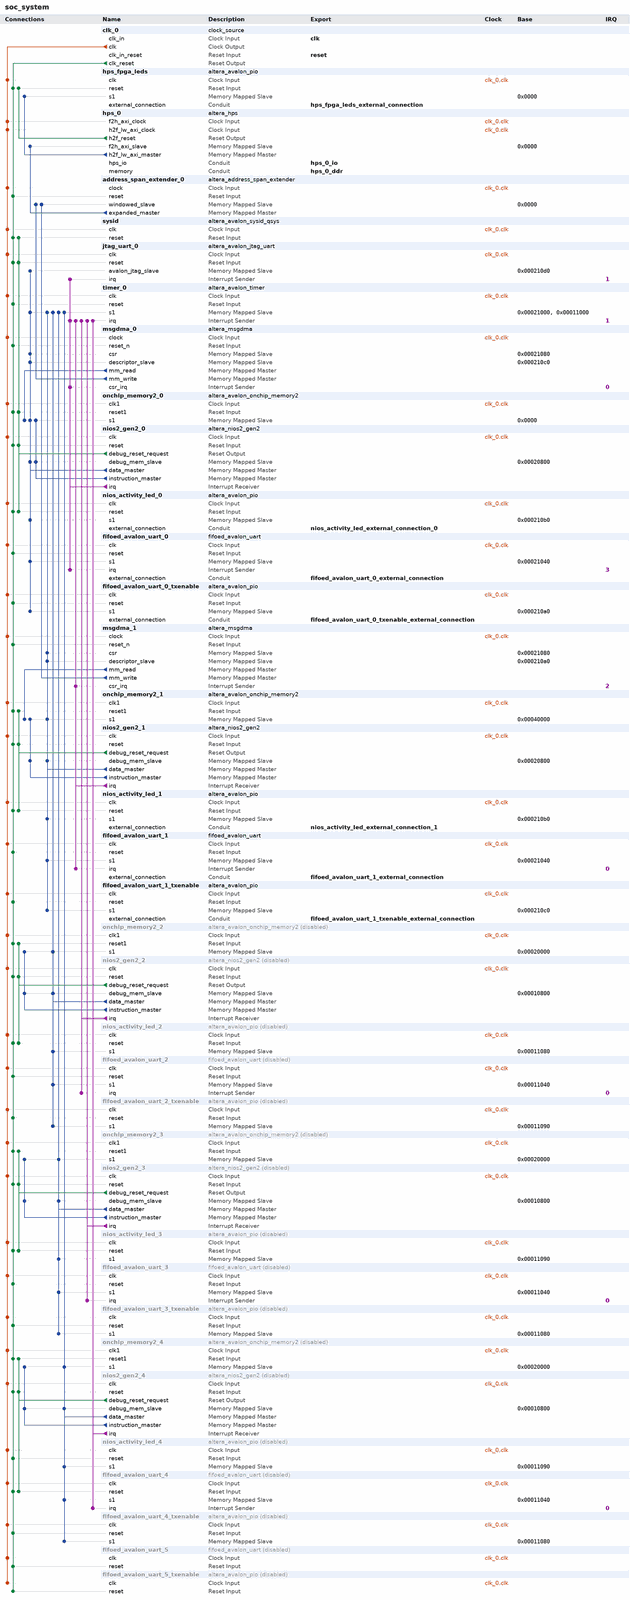
[diagram p0: system contents, whole]
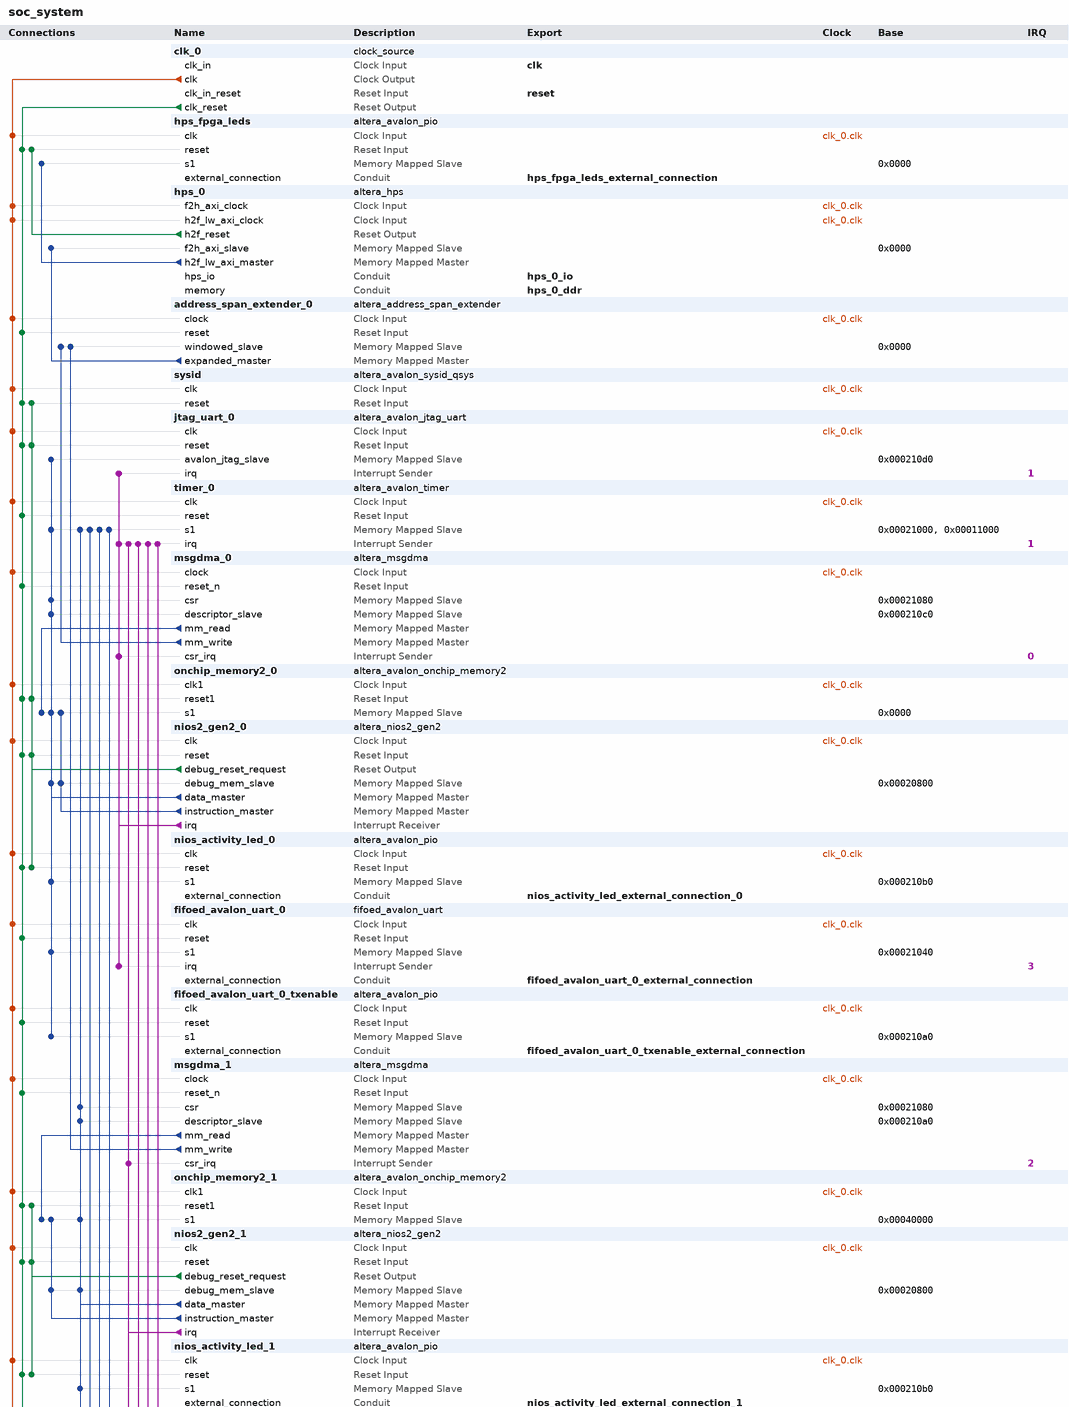
[diagram p1: system contents, upper part]
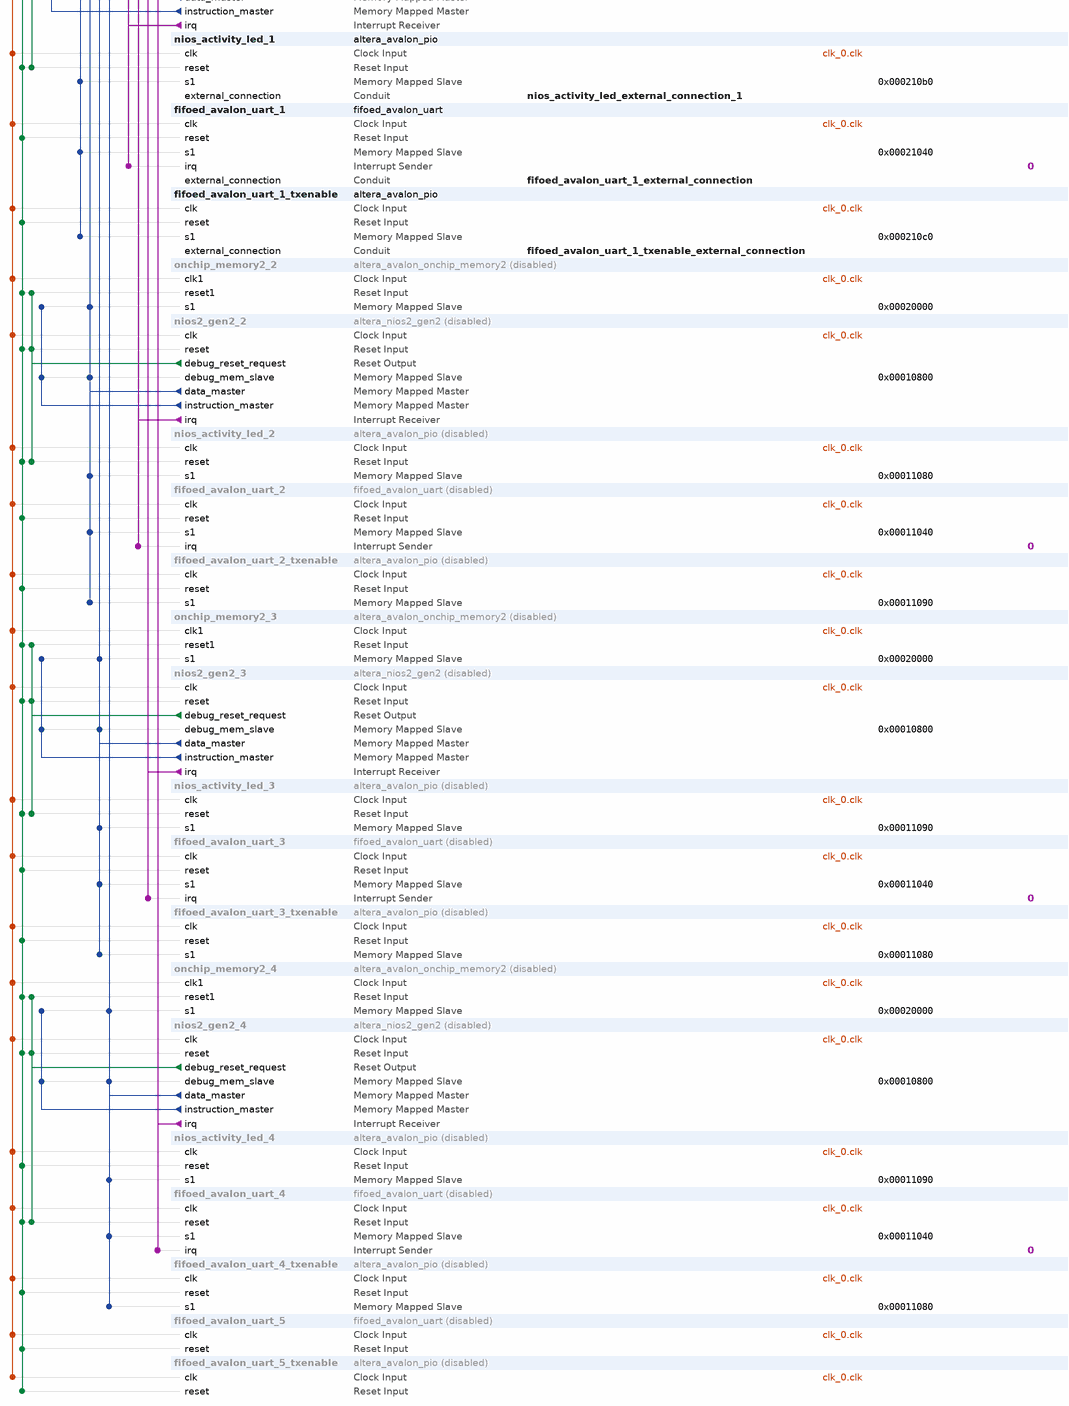
[diagram p2: system contents, lower part]
# Platform Designer (Qsys) system soc_system, Cyclone V 5CSEMA4U23C6
# Parameters at their usual value, and those the tool derives, are not listed.
package require -exact qsys 18.0
create_system soc_system
set_project_property DEVICE_FAMILY {Cyclone V}
set_project_property DEVICE 5CSEMA4U23C6

add_instance clk_0 clock_source 18.0
set_instance_parameter_value clk_0 clockFrequency 50000000

add_instance hps_fpga_leds altera_avalon_pio 18.0
set_instance_parameter_value hps_fpga_leds direction Output
set_instance_parameter_value hps_fpga_leds width 2

add_instance hps_0 altera_hps 18.0
set_instance_parameter_value hps_0 EMAC1_Mode RGMII
set_instance_parameter_value hps_0 EMAC1_PinMuxing {HPS I/O Set 0}
set_instance_parameter_value hps_0 F2SCLK_COLDRST_Enable false
set_instance_parameter_value hps_0 F2SCLK_DBGRST_Enable false
set_instance_parameter_value hps_0 F2SCLK_WARMRST_Enable false
set_instance_parameter_value hps_0 F2SINTERRUPT_Enable false
set_instance_parameter_value hps_0 F2S_Width 3
set_instance_parameter_value hps_0 FPGA_PERIPHERAL_OUTPUT_CLOCK_FREQ_EMAC0_GTX_CLK 125
set_instance_parameter_value hps_0 FPGA_PERIPHERAL_OUTPUT_CLOCK_FREQ_EMAC0_MD_CLK 2.5
set_instance_parameter_value hps_0 FPGA_PERIPHERAL_OUTPUT_CLOCK_FREQ_EMAC1_GTX_CLK 125
set_instance_parameter_value hps_0 FPGA_PERIPHERAL_OUTPUT_CLOCK_FREQ_EMAC1_MD_CLK 2.5
set_instance_parameter_value hps_0 HPS_PROTOCOL DDR3
set_instance_parameter_value hps_0 I2C0_Mode I2C
set_instance_parameter_value hps_0 I2C0_PinMuxing {HPS I/O Set 0}
set_instance_parameter_value hps_0 I2C1_Mode I2C
set_instance_parameter_value hps_0 I2C1_PinMuxing {HPS I/O Set 0}
set_instance_parameter_value hps_0 LWH2F_Enable true
set_instance_parameter_value hps_0 MEM_BANKADDR_WIDTH 3
set_instance_parameter_value hps_0 MEM_CLK_FREQ 400.0
set_instance_parameter_value hps_0 MEM_COL_ADDR_WIDTH 10
set_instance_parameter_value hps_0 MEM_DQ_WIDTH 32
set_instance_parameter_value hps_0 MEM_DRV_STR RZQ/6
set_instance_parameter_value hps_0 MEM_ROW_ADDR_WIDTH 15
set_instance_parameter_value hps_0 MEM_RTT_NOM RZQ/6
set_instance_parameter_value hps_0 MEM_RTT_WR {Dynamic ODT off}
set_instance_parameter_value hps_0 MEM_TCL 7
set_instance_parameter_value hps_0 MEM_TFAW_NS 37.5
set_instance_parameter_value hps_0 MEM_TRAS_NS 35.0
set_instance_parameter_value hps_0 MEM_TRCD_NS 13.75
set_instance_parameter_value hps_0 MEM_TRFC_NS 300.0
set_instance_parameter_value hps_0 MEM_TRP_NS 13.75
set_instance_parameter_value hps_0 MEM_VENDOR Other
set_instance_parameter_value hps_0 MEM_WTCL 7
set_instance_parameter_value hps_0 QSPI_Mode N/A
set_instance_parameter_value hps_0 QSPI_PinMuxing Unused
set_instance_parameter_value hps_0 REF_CLK_FREQ 25.0
set_instance_parameter_value hps_0 S2FCLK_USER2CLK 1
set_instance_parameter_value hps_0 S2F_Width 0
set_instance_parameter_value hps_0 SDIO_Mode {4-bit Data}
set_instance_parameter_value hps_0 SDIO_PinMuxing {HPS I/O Set 0}
set_instance_parameter_value hps_0 SPIM1_Mode {Single Slave Select}
set_instance_parameter_value hps_0 SPIM1_PinMuxing {HPS I/O Set 0}
set_instance_parameter_value hps_0 STM_Enable false
set_instance_parameter_value hps_0 TIMING_BOARD_AC_SKEW 0.02
set_instance_parameter_value hps_0 TIMING_BOARD_AC_TO_CK_SKEW 0.0
set_instance_parameter_value hps_0 TIMING_BOARD_DQ_TO_DQS_SKEW 0.0
set_instance_parameter_value hps_0 TIMING_BOARD_MAX_CK_DELAY 0.6
set_instance_parameter_value hps_0 TIMING_BOARD_MAX_DQS_DELAY 0.6
set_instance_parameter_value hps_0 TIMING_BOARD_SKEW_BETWEEN_DQS 0.02
set_instance_parameter_value hps_0 TIMING_BOARD_SKEW_CKDQS_DIMM_MAX 0.01
set_instance_parameter_value hps_0 TIMING_BOARD_SKEW_CKDQS_DIMM_MIN -0.01
set_instance_parameter_value hps_0 TIMING_BOARD_SKEW_WITHIN_DQS 0.02
set_instance_parameter_value hps_0 TIMING_TDH 125
set_instance_parameter_value hps_0 TIMING_TDQSCK 400
set_instance_parameter_value hps_0 TIMING_TDQSQ 120
set_instance_parameter_value hps_0 TIMING_TDS 50
set_instance_parameter_value hps_0 TIMING_TIH 250
set_instance_parameter_value hps_0 TIMING_TIS 175
set_instance_parameter_value hps_0 TIMING_TQSH 0.38
set_instance_parameter_value hps_0 UART0_Mode {No Flow Control}
set_instance_parameter_value hps_0 UART0_PinMuxing {HPS I/O Set 0}
set_instance_parameter_value hps_0 USB1_Mode SDR
set_instance_parameter_value hps_0 USB1_PinMuxing {HPS I/O Set 0}
set_instance_parameter_value hps_0 desired_cfg_clk_mhz 100.0
set_instance_parameter_value hps_0 desired_qspi_clk_mhz 400.0

add_instance address_span_extender_0 altera_address_span_extender 18.0
set_instance_parameter_value address_span_extender_0 BURSTCOUNT_WIDTH 8
set_instance_parameter_value address_span_extender_0 DATA_WIDTH 32
set_instance_parameter_value address_span_extender_0 ENABLE_SLAVE_PORT false
set_instance_parameter_value address_span_extender_0 MASTER_ADDRESS_DEF 536870912
set_instance_parameter_value address_span_extender_0 MAX_PENDING_READS 1
set_instance_parameter_value address_span_extender_0 SLAVE_ADDRESS_WIDTH 27

add_instance sysid altera_avalon_sysid_qsys 18.0
set_instance_parameter_value sysid id 0

add_instance jtag_uart_0 altera_avalon_jtag_uart 18.0
set_instance_parameter_value jtag_uart_0 simInteractiveOptions NO_INTERACTIVE_WINDOWS

add_instance timer_0 altera_avalon_timer 18.0
set_instance_parameter_value timer_0 alwaysRun true
set_instance_parameter_value timer_0 counterSize 64
set_instance_parameter_value timer_0 period 1
set_instance_parameter_value timer_0 periodUnits MSEC

add_instance msgdma_0 altera_msgdma 18.0
set_instance_parameter_value msgdma_0 BURST_ENABLE 0
set_instance_parameter_value msgdma_0 DATA_FIFO_DEPTH 32
set_instance_parameter_value msgdma_0 DATA_WIDTH 32
set_instance_parameter_value msgdma_0 DESCRIPTOR_FIFO_DEPTH 128
set_instance_parameter_value msgdma_0 ENHANCED_FEATURES 0
set_instance_parameter_value msgdma_0 ERROR_ENABLE 0
set_instance_parameter_value msgdma_0 MAX_BURST_COUNT 2
set_instance_parameter_value msgdma_0 MAX_BYTE 8192
set_instance_parameter_value msgdma_0 MODE 0
set_instance_parameter_value msgdma_0 PACKET_ENABLE 0
set_instance_parameter_value msgdma_0 TRANSFER_TYPE {Unaligned Accesses}

add_instance onchip_memory2_0 altera_avalon_onchip_memory2 18.0
set_instance_parameter_value onchip_memory2_0 dataWidth 32
set_instance_parameter_value onchip_memory2_0 dualPort false
set_instance_parameter_value onchip_memory2_0 initMemContent true
set_instance_parameter_value onchip_memory2_0 initializationFileName mem_init_NIOS_0/soc_system_onchip_memory2_0.hex
set_instance_parameter_value onchip_memory2_0 memorySize 131072
set_instance_parameter_value onchip_memory2_0 useNonDefaultInitFile true

add_instance nios2_gen2_0 altera_nios2_gen2 18.0
set_instance_parameter_value nios2_gen2_0 dcache_size 2048
set_instance_parameter_value nios2_gen2_0 exceptionSlave onchip_memory2_0.s1
set_instance_parameter_value nios2_gen2_0 icache_size 4096
set_instance_parameter_value nios2_gen2_0 impl Tiny
set_instance_parameter_value nios2_gen2_0 resetSlave onchip_memory2_0.s1

add_instance nios_activity_led_0 altera_avalon_pio 18.0
set_instance_parameter_value nios_activity_led_0 direction Output
set_instance_parameter_value nios_activity_led_0 width 1

add_instance fifoed_avalon_uart_0 fifoed_avalon_uart 13.2
set_instance_parameter_value fifoed_avalon_uart_0 add_error_bits false
set_instance_parameter_value fifoed_avalon_uart_0 baud 1000000
set_instance_parameter_value fifoed_avalon_uart_0 dataBits 8
set_instance_parameter_value fifoed_avalon_uart_0 driver_pass_error_bits false
set_instance_parameter_value fifoed_avalon_uart_0 export_handshake false
set_instance_parameter_value fifoed_avalon_uart_0 fifo_export_used false
set_instance_parameter_value fifoed_avalon_uart_0 fifo_size_rx 256
set_instance_parameter_value fifoed_avalon_uart_0 fifo_size_tx 8
set_instance_parameter_value fifoed_avalon_uart_0 fixedBaud true
set_instance_parameter_value fifoed_avalon_uart_0 gap_value 3
set_instance_parameter_value fifoed_avalon_uart_0 hw_cts false
set_instance_parameter_value fifoed_avalon_uart_0 parity EVEN
set_instance_parameter_value fifoed_avalon_uart_0 rx_IRQ_Threshold 1
set_instance_parameter_value fifoed_avalon_uart_0 rx_fifo_LE false
set_instance_parameter_value fifoed_avalon_uart_0 simInteractiveInputEnable false
set_instance_parameter_value fifoed_avalon_uart_0 simInteractiveOutputEnable false
set_instance_parameter_value fifoed_avalon_uart_0 simTrueBaud false
set_instance_parameter_value fifoed_avalon_uart_0 stopBits 1
set_instance_parameter_value fifoed_avalon_uart_0 syncRegDepth 2
set_instance_parameter_value fifoed_avalon_uart_0 timeout_value 10
set_instance_parameter_value fifoed_avalon_uart_0 timestamp_width 8
set_instance_parameter_value fifoed_avalon_uart_0 trans_pin false
set_instance_parameter_value fifoed_avalon_uart_0 tx_IRQ_Threshold 1
set_instance_parameter_value fifoed_avalon_uart_0 tx_fifo_LE false
set_instance_parameter_value fifoed_avalon_uart_0 useCtsRts false
set_instance_parameter_value fifoed_avalon_uart_0 useEopRegister false
set_instance_parameter_value fifoed_avalon_uart_0 useRelativePathForSimFile false
set_instance_parameter_value fifoed_avalon_uart_0 use_ext_timestamp false
set_instance_parameter_value fifoed_avalon_uart_0 use_gap_detection true
set_instance_parameter_value fifoed_avalon_uart_0 use_rx_fifo true
set_instance_parameter_value fifoed_avalon_uart_0 use_status_bit_clear false
set_instance_parameter_value fifoed_avalon_uart_0 use_timestamp false
set_instance_parameter_value fifoed_avalon_uart_0 use_timout false
set_instance_parameter_value fifoed_avalon_uart_0 use_tx_fifo false

add_instance fifoed_avalon_uart_0_txenable altera_avalon_pio 18.0
set_instance_parameter_value fifoed_avalon_uart_0_txenable direction Output
set_instance_parameter_value fifoed_avalon_uart_0_txenable width 1

add_instance msgdma_1 altera_msgdma 18.0
set_instance_parameter_value msgdma_1 BURST_ENABLE 0
set_instance_parameter_value msgdma_1 DATA_FIFO_DEPTH 32
set_instance_parameter_value msgdma_1 DATA_WIDTH 32
set_instance_parameter_value msgdma_1 DESCRIPTOR_FIFO_DEPTH 128
set_instance_parameter_value msgdma_1 ENHANCED_FEATURES 0
set_instance_parameter_value msgdma_1 ERROR_ENABLE 0
set_instance_parameter_value msgdma_1 MAX_BURST_COUNT 2
set_instance_parameter_value msgdma_1 MAX_BYTE 8192
set_instance_parameter_value msgdma_1 MODE 0
set_instance_parameter_value msgdma_1 PACKET_ENABLE 0
set_instance_parameter_value msgdma_1 TRANSFER_TYPE {Unaligned Accesses}

add_instance onchip_memory2_1 altera_avalon_onchip_memory2 18.0
set_instance_parameter_value onchip_memory2_1 dataWidth 32
set_instance_parameter_value onchip_memory2_1 dualPort false
set_instance_parameter_value onchip_memory2_1 initMemContent true
set_instance_parameter_value onchip_memory2_1 initializationFileName mem_init_NIOS_1/soc_system_onchip_memory2_1.hex
set_instance_parameter_value onchip_memory2_1 memorySize 131072
set_instance_parameter_value onchip_memory2_1 useNonDefaultInitFile true

add_instance nios2_gen2_1 altera_nios2_gen2 18.0
set_instance_parameter_value nios2_gen2_1 dcache_size 2048
set_instance_parameter_value nios2_gen2_1 exceptionSlave onchip_memory2_1.s1
set_instance_parameter_value nios2_gen2_1 icache_size 4096
set_instance_parameter_value nios2_gen2_1 impl Tiny
set_instance_parameter_value nios2_gen2_1 resetSlave onchip_memory2_1.s1

add_instance nios_activity_led_1 altera_avalon_pio 18.0
set_instance_parameter_value nios_activity_led_1 direction Output
set_instance_parameter_value nios_activity_led_1 width 1

add_instance fifoed_avalon_uart_1 fifoed_avalon_uart 13.2
set_instance_parameter_value fifoed_avalon_uart_1 add_error_bits false
set_instance_parameter_value fifoed_avalon_uart_1 baud 1000000
set_instance_parameter_value fifoed_avalon_uart_1 dataBits 8
set_instance_parameter_value fifoed_avalon_uart_1 driver_pass_error_bits false
set_instance_parameter_value fifoed_avalon_uart_1 export_handshake false
set_instance_parameter_value fifoed_avalon_uart_1 fifo_export_used false
set_instance_parameter_value fifoed_avalon_uart_1 fifo_size_rx 256
set_instance_parameter_value fifoed_avalon_uart_1 fifo_size_tx 8
set_instance_parameter_value fifoed_avalon_uart_1 fixedBaud true
set_instance_parameter_value fifoed_avalon_uart_1 gap_value 3
set_instance_parameter_value fifoed_avalon_uart_1 hw_cts false
set_instance_parameter_value fifoed_avalon_uart_1 parity NONE
set_instance_parameter_value fifoed_avalon_uart_1 rx_IRQ_Threshold 1
set_instance_parameter_value fifoed_avalon_uart_1 rx_fifo_LE false
set_instance_parameter_value fifoed_avalon_uart_1 simInteractiveInputEnable false
set_instance_parameter_value fifoed_avalon_uart_1 simInteractiveOutputEnable false
set_instance_parameter_value fifoed_avalon_uart_1 simTrueBaud false
set_instance_parameter_value fifoed_avalon_uart_1 stopBits 1
set_instance_parameter_value fifoed_avalon_uart_1 syncRegDepth 2
set_instance_parameter_value fifoed_avalon_uart_1 timeout_value 4
set_instance_parameter_value fifoed_avalon_uart_1 timestamp_width 8
set_instance_parameter_value fifoed_avalon_uart_1 trans_pin false
set_instance_parameter_value fifoed_avalon_uart_1 tx_IRQ_Threshold 1
set_instance_parameter_value fifoed_avalon_uart_1 tx_fifo_LE false
set_instance_parameter_value fifoed_avalon_uart_1 useCtsRts false
set_instance_parameter_value fifoed_avalon_uart_1 useEopRegister false
set_instance_parameter_value fifoed_avalon_uart_1 useRelativePathForSimFile false
set_instance_parameter_value fifoed_avalon_uart_1 use_ext_timestamp false
set_instance_parameter_value fifoed_avalon_uart_1 use_gap_detection true
set_instance_parameter_value fifoed_avalon_uart_1 use_rx_fifo true
set_instance_parameter_value fifoed_avalon_uart_1 use_status_bit_clear false
set_instance_parameter_value fifoed_avalon_uart_1 use_timestamp false
set_instance_parameter_value fifoed_avalon_uart_1 use_timout false
set_instance_parameter_value fifoed_avalon_uart_1 use_tx_fifo false

add_instance fifoed_avalon_uart_1_txenable altera_avalon_pio 18.0
set_instance_parameter_value fifoed_avalon_uart_1_txenable direction Output
set_instance_parameter_value fifoed_avalon_uart_1_txenable width 1

add_instance onchip_memory2_2 altera_avalon_onchip_memory2 18.0
set_instance_property onchip_memory2_2 ENABLED false
set_instance_parameter_value onchip_memory2_2 dataWidth 32
set_instance_parameter_value onchip_memory2_2 dualPort false
set_instance_parameter_value onchip_memory2_2 initMemContent true
set_instance_parameter_value onchip_memory2_2 initializationFileName onchip_mem.hex
set_instance_parameter_value onchip_memory2_2 memorySize 49152

add_instance nios2_gen2_2 altera_nios2_gen2 18.0
set_instance_property nios2_gen2_2 ENABLED false
set_instance_parameter_value nios2_gen2_2 dcache_size 2048
set_instance_parameter_value nios2_gen2_2 exceptionSlave onchip_memory2_2.s1
set_instance_parameter_value nios2_gen2_2 icache_size 4096
set_instance_parameter_value nios2_gen2_2 impl Tiny
set_instance_parameter_value nios2_gen2_2 resetSlave onchip_memory2_2.s1

add_instance nios_activity_led_2 altera_avalon_pio 18.0
set_instance_property nios_activity_led_2 ENABLED false
set_instance_parameter_value nios_activity_led_2 direction Output
set_instance_parameter_value nios_activity_led_2 width 1

add_instance fifoed_avalon_uart_2 fifoed_avalon_uart 13.2
set_instance_property fifoed_avalon_uart_2 ENABLED false
set_instance_parameter_value fifoed_avalon_uart_2 add_error_bits false
set_instance_parameter_value fifoed_avalon_uart_2 baud 1000000
set_instance_parameter_value fifoed_avalon_uart_2 dataBits 8
set_instance_parameter_value fifoed_avalon_uart_2 driver_pass_error_bits false
set_instance_parameter_value fifoed_avalon_uart_2 export_handshake false
set_instance_parameter_value fifoed_avalon_uart_2 fifo_export_used false
set_instance_parameter_value fifoed_avalon_uart_2 fifo_size_rx 128
set_instance_parameter_value fifoed_avalon_uart_2 fifo_size_tx 8
set_instance_parameter_value fifoed_avalon_uart_2 fixedBaud true
set_instance_parameter_value fifoed_avalon_uart_2 gap_value 3
set_instance_parameter_value fifoed_avalon_uart_2 hw_cts false
set_instance_parameter_value fifoed_avalon_uart_2 parity NONE
set_instance_parameter_value fifoed_avalon_uart_2 rx_IRQ_Threshold 1
set_instance_parameter_value fifoed_avalon_uart_2 rx_fifo_LE false
set_instance_parameter_value fifoed_avalon_uart_2 simInteractiveInputEnable false
set_instance_parameter_value fifoed_avalon_uart_2 simInteractiveOutputEnable false
set_instance_parameter_value fifoed_avalon_uart_2 simTrueBaud false
set_instance_parameter_value fifoed_avalon_uart_2 stopBits 1
set_instance_parameter_value fifoed_avalon_uart_2 syncRegDepth 2
set_instance_parameter_value fifoed_avalon_uart_2 timeout_value 4
set_instance_parameter_value fifoed_avalon_uart_2 timestamp_width 8
set_instance_parameter_value fifoed_avalon_uart_2 trans_pin false
set_instance_parameter_value fifoed_avalon_uart_2 tx_IRQ_Threshold 1
set_instance_parameter_value fifoed_avalon_uart_2 tx_fifo_LE false
set_instance_parameter_value fifoed_avalon_uart_2 useCtsRts false
set_instance_parameter_value fifoed_avalon_uart_2 useEopRegister false
set_instance_parameter_value fifoed_avalon_uart_2 useRelativePathForSimFile false
set_instance_parameter_value fifoed_avalon_uart_2 use_ext_timestamp false
set_instance_parameter_value fifoed_avalon_uart_2 use_gap_detection true
set_instance_parameter_value fifoed_avalon_uart_2 use_rx_fifo true
set_instance_parameter_value fifoed_avalon_uart_2 use_status_bit_clear false
set_instance_parameter_value fifoed_avalon_uart_2 use_timestamp false
set_instance_parameter_value fifoed_avalon_uart_2 use_timout false
set_instance_parameter_value fifoed_avalon_uart_2 use_tx_fifo false

add_instance fifoed_avalon_uart_2_txenable altera_avalon_pio 18.0
set_instance_property fifoed_avalon_uart_2_txenable ENABLED false
set_instance_parameter_value fifoed_avalon_uart_2_txenable direction Output
set_instance_parameter_value fifoed_avalon_uart_2_txenable width 1

add_instance onchip_memory2_3 altera_avalon_onchip_memory2 18.0
set_instance_property onchip_memory2_3 ENABLED false
set_instance_parameter_value onchip_memory2_3 dataWidth 32
set_instance_parameter_value onchip_memory2_3 dualPort false
set_instance_parameter_value onchip_memory2_3 initMemContent true
set_instance_parameter_value onchip_memory2_3 initializationFileName onchip_mem.hex
set_instance_parameter_value onchip_memory2_3 memorySize 49152

add_instance nios2_gen2_3 altera_nios2_gen2 18.0
set_instance_property nios2_gen2_3 ENABLED false
set_instance_parameter_value nios2_gen2_3 dcache_size 2048
set_instance_parameter_value nios2_gen2_3 exceptionSlave onchip_memory2_3.s1
set_instance_parameter_value nios2_gen2_3 icache_size 4096
set_instance_parameter_value nios2_gen2_3 impl Tiny
set_instance_parameter_value nios2_gen2_3 resetSlave onchip_memory2_3.s1

add_instance nios_activity_led_3 altera_avalon_pio 18.0
set_instance_property nios_activity_led_3 ENABLED false
set_instance_parameter_value nios_activity_led_3 direction Output
set_instance_parameter_value nios_activity_led_3 width 1

add_instance fifoed_avalon_uart_3 fifoed_avalon_uart 13.2
set_instance_property fifoed_avalon_uart_3 ENABLED false
set_instance_parameter_value fifoed_avalon_uart_3 add_error_bits false
set_instance_parameter_value fifoed_avalon_uart_3 baud 1000000
set_instance_parameter_value fifoed_avalon_uart_3 dataBits 8
set_instance_parameter_value fifoed_avalon_uart_3 driver_pass_error_bits false
set_instance_parameter_value fifoed_avalon_uart_3 export_handshake false
set_instance_parameter_value fifoed_avalon_uart_3 fifo_export_used false
set_instance_parameter_value fifoed_avalon_uart_3 fifo_size_rx 128
set_instance_parameter_value fifoed_avalon_uart_3 fifo_size_tx 8
set_instance_parameter_value fifoed_avalon_uart_3 fixedBaud true
set_instance_parameter_value fifoed_avalon_uart_3 gap_value 4
set_instance_parameter_value fifoed_avalon_uart_3 hw_cts false
set_instance_parameter_value fifoed_avalon_uart_3 parity NONE
set_instance_parameter_value fifoed_avalon_uart_3 rx_IRQ_Threshold 1
set_instance_parameter_value fifoed_avalon_uart_3 rx_fifo_LE false
set_instance_parameter_value fifoed_avalon_uart_3 simInteractiveInputEnable false
set_instance_parameter_value fifoed_avalon_uart_3 simInteractiveOutputEnable false
set_instance_parameter_value fifoed_avalon_uart_3 simTrueBaud false
set_instance_parameter_value fifoed_avalon_uart_3 stopBits 1
set_instance_parameter_value fifoed_avalon_uart_3 syncRegDepth 2
set_instance_parameter_value fifoed_avalon_uart_3 timeout_value 4
set_instance_parameter_value fifoed_avalon_uart_3 timestamp_width 8
set_instance_parameter_value fifoed_avalon_uart_3 trans_pin false
set_instance_parameter_value fifoed_avalon_uart_3 tx_IRQ_Threshold 1
set_instance_parameter_value fifoed_avalon_uart_3 tx_fifo_LE false
set_instance_parameter_value fifoed_avalon_uart_3 useCtsRts false
set_instance_parameter_value fifoed_avalon_uart_3 useEopRegister false
set_instance_parameter_value fifoed_avalon_uart_3 useRelativePathForSimFile false
set_instance_parameter_value fifoed_avalon_uart_3 use_ext_timestamp false
set_instance_parameter_value fifoed_avalon_uart_3 use_gap_detection true
set_instance_parameter_value fifoed_avalon_uart_3 use_rx_fifo true
set_instance_parameter_value fifoed_avalon_uart_3 use_status_bit_clear false
set_instance_parameter_value fifoed_avalon_uart_3 use_timestamp false
set_instance_parameter_value fifoed_avalon_uart_3 use_timout false
set_instance_parameter_value fifoed_avalon_uart_3 use_tx_fifo false

add_instance fifoed_avalon_uart_3_txenable altera_avalon_pio 18.0
set_instance_property fifoed_avalon_uart_3_txenable ENABLED false
set_instance_parameter_value fifoed_avalon_uart_3_txenable direction Output
set_instance_parameter_value fifoed_avalon_uart_3_txenable width 1

add_instance onchip_memory2_4 altera_avalon_onchip_memory2 18.0
set_instance_property onchip_memory2_4 ENABLED false
set_instance_parameter_value onchip_memory2_4 dataWidth 32
set_instance_parameter_value onchip_memory2_4 dualPort false
set_instance_parameter_value onchip_memory2_4 initMemContent true
set_instance_parameter_value onchip_memory2_4 initializationFileName onchip_mem.hex
set_instance_parameter_value onchip_memory2_4 memorySize 49152

add_instance nios2_gen2_4 altera_nios2_gen2 18.0
set_instance_property nios2_gen2_4 ENABLED false
set_instance_parameter_value nios2_gen2_4 dcache_size 2048
set_instance_parameter_value nios2_gen2_4 exceptionSlave onchip_memory2_4.s1
set_instance_parameter_value nios2_gen2_4 icache_size 4096
set_instance_parameter_value nios2_gen2_4 impl Tiny
set_instance_parameter_value nios2_gen2_4 resetSlave onchip_memory2_4.s1

add_instance nios_activity_led_4 altera_avalon_pio 18.0
set_instance_property nios_activity_led_4 ENABLED false
set_instance_parameter_value nios_activity_led_4 direction Output
set_instance_parameter_value nios_activity_led_4 width 2

add_instance fifoed_avalon_uart_4 fifoed_avalon_uart 13.2
set_instance_property fifoed_avalon_uart_4 ENABLED false
set_instance_parameter_value fifoed_avalon_uart_4 add_error_bits false
set_instance_parameter_value fifoed_avalon_uart_4 baud 1000000
set_instance_parameter_value fifoed_avalon_uart_4 dataBits 8
set_instance_parameter_value fifoed_avalon_uart_4 driver_pass_error_bits false
set_instance_parameter_value fifoed_avalon_uart_4 export_handshake false
set_instance_parameter_value fifoed_avalon_uart_4 fifo_export_used false
set_instance_parameter_value fifoed_avalon_uart_4 fifo_size_rx 128
set_instance_parameter_value fifoed_avalon_uart_4 fifo_size_tx 8
set_instance_parameter_value fifoed_avalon_uart_4 fixedBaud true
set_instance_parameter_value fifoed_avalon_uart_4 gap_value 5
set_instance_parameter_value fifoed_avalon_uart_4 hw_cts false
set_instance_parameter_value fifoed_avalon_uart_4 parity NONE
set_instance_parameter_value fifoed_avalon_uart_4 rx_IRQ_Threshold 1
set_instance_parameter_value fifoed_avalon_uart_4 rx_fifo_LE false
set_instance_parameter_value fifoed_avalon_uart_4 simInteractiveInputEnable false
set_instance_parameter_value fifoed_avalon_uart_4 simInteractiveOutputEnable false
set_instance_parameter_value fifoed_avalon_uart_4 simTrueBaud false
set_instance_parameter_value fifoed_avalon_uart_4 stopBits 1
set_instance_parameter_value fifoed_avalon_uart_4 syncRegDepth 2
set_instance_parameter_value fifoed_avalon_uart_4 timeout_value 4
set_instance_parameter_value fifoed_avalon_uart_4 timestamp_width 8
set_instance_parameter_value fifoed_avalon_uart_4 trans_pin false
set_instance_parameter_value fifoed_avalon_uart_4 tx_IRQ_Threshold 1
set_instance_parameter_value fifoed_avalon_uart_4 tx_fifo_LE false
set_instance_parameter_value fifoed_avalon_uart_4 useCtsRts false
set_instance_parameter_value fifoed_avalon_uart_4 useEopRegister false
set_instance_parameter_value fifoed_avalon_uart_4 useRelativePathForSimFile false
set_instance_parameter_value fifoed_avalon_uart_4 use_ext_timestamp false
set_instance_parameter_value fifoed_avalon_uart_4 use_gap_detection true
set_instance_parameter_value fifoed_avalon_uart_4 use_rx_fifo true
set_instance_parameter_value fifoed_avalon_uart_4 use_status_bit_clear false
set_instance_parameter_value fifoed_avalon_uart_4 use_timestamp false
set_instance_parameter_value fifoed_avalon_uart_4 use_timout false
set_instance_parameter_value fifoed_avalon_uart_4 use_tx_fifo false

add_instance fifoed_avalon_uart_4_txenable altera_avalon_pio 18.0
set_instance_property fifoed_avalon_uart_4_txenable ENABLED false
set_instance_parameter_value fifoed_avalon_uart_4_txenable direction Output
set_instance_parameter_value fifoed_avalon_uart_4_txenable width 1

add_instance fifoed_avalon_uart_5 fifoed_avalon_uart 13.2
set_instance_property fifoed_avalon_uart_5 ENABLED false
set_instance_parameter_value fifoed_avalon_uart_5 add_error_bits false
set_instance_parameter_value fifoed_avalon_uart_5 baud 1000000
set_instance_parameter_value fifoed_avalon_uart_5 dataBits 8
set_instance_parameter_value fifoed_avalon_uart_5 driver_pass_error_bits false
set_instance_parameter_value fifoed_avalon_uart_5 export_handshake false
set_instance_parameter_value fifoed_avalon_uart_5 fifo_export_used false
set_instance_parameter_value fifoed_avalon_uart_5 fifo_size_rx 128
set_instance_parameter_value fifoed_avalon_uart_5 fifo_size_tx 8
set_instance_parameter_value fifoed_avalon_uart_5 fixedBaud true
set_instance_parameter_value fifoed_avalon_uart_5 gap_value 10
set_instance_parameter_value fifoed_avalon_uart_5 hw_cts false
set_instance_parameter_value fifoed_avalon_uart_5 parity NONE
set_instance_parameter_value fifoed_avalon_uart_5 rx_IRQ_Threshold 1
set_instance_parameter_value fifoed_avalon_uart_5 rx_fifo_LE false
set_instance_parameter_value fifoed_avalon_uart_5 simInteractiveInputEnable false
set_instance_parameter_value fifoed_avalon_uart_5 simInteractiveOutputEnable false
set_instance_parameter_value fifoed_avalon_uart_5 simTrueBaud false
set_instance_parameter_value fifoed_avalon_uart_5 stopBits 1
set_instance_parameter_value fifoed_avalon_uart_5 syncRegDepth 2
set_instance_parameter_value fifoed_avalon_uart_5 timeout_value 4
set_instance_parameter_value fifoed_avalon_uart_5 timestamp_width 8
set_instance_parameter_value fifoed_avalon_uart_5 trans_pin false
set_instance_parameter_value fifoed_avalon_uart_5 tx_IRQ_Threshold 1
set_instance_parameter_value fifoed_avalon_uart_5 tx_fifo_LE false
set_instance_parameter_value fifoed_avalon_uart_5 useCtsRts false
set_instance_parameter_value fifoed_avalon_uart_5 useEopRegister false
set_instance_parameter_value fifoed_avalon_uart_5 useRelativePathForSimFile false
set_instance_parameter_value fifoed_avalon_uart_5 use_ext_timestamp false
set_instance_parameter_value fifoed_avalon_uart_5 use_gap_detection true
set_instance_parameter_value fifoed_avalon_uart_5 use_rx_fifo true
set_instance_parameter_value fifoed_avalon_uart_5 use_status_bit_clear false
set_instance_parameter_value fifoed_avalon_uart_5 use_timestamp false
set_instance_parameter_value fifoed_avalon_uart_5 use_timout false
set_instance_parameter_value fifoed_avalon_uart_5 use_tx_fifo false

add_instance fifoed_avalon_uart_5_txenable altera_avalon_pio 18.0
set_instance_property fifoed_avalon_uart_5_txenable ENABLED false
set_instance_parameter_value fifoed_avalon_uart_5_txenable direction Output
set_instance_parameter_value fifoed_avalon_uart_5_txenable width 1

# connections
add_connection clk_0.clk address_span_extender_0.clock clock
add_connection clk_0.clk fifoed_avalon_uart_0.clk clock
add_connection clk_0.clk fifoed_avalon_uart_0_txenable.clk clock
add_connection clk_0.clk fifoed_avalon_uart_1.clk clock
add_connection clk_0.clk fifoed_avalon_uart_1_txenable.clk clock
add_connection clk_0.clk fifoed_avalon_uart_2.clk clock
add_connection clk_0.clk fifoed_avalon_uart_2_txenable.clk clock
add_connection clk_0.clk fifoed_avalon_uart_3.clk clock
add_connection clk_0.clk fifoed_avalon_uart_3_txenable.clk clock
add_connection clk_0.clk fifoed_avalon_uart_4.clk clock
add_connection clk_0.clk fifoed_avalon_uart_4_txenable.clk clock
add_connection clk_0.clk fifoed_avalon_uart_5.clk clock
add_connection clk_0.clk fifoed_avalon_uart_5_txenable.clk clock
add_connection clk_0.clk hps_0.f2h_axi_clock clock
add_connection clk_0.clk hps_0.h2f_lw_axi_clock clock
add_connection clk_0.clk hps_fpga_leds.clk clock
add_connection clk_0.clk jtag_uart_0.clk clock
add_connection clk_0.clk msgdma_0.clock clock
add_connection clk_0.clk msgdma_1.clock clock
add_connection clk_0.clk nios2_gen2_0.clk clock
add_connection clk_0.clk nios2_gen2_1.clk clock
add_connection clk_0.clk nios2_gen2_2.clk clock
add_connection clk_0.clk nios2_gen2_3.clk clock
add_connection clk_0.clk nios2_gen2_4.clk clock
add_connection clk_0.clk nios_activity_led_0.clk clock
add_connection clk_0.clk nios_activity_led_1.clk clock
add_connection clk_0.clk nios_activity_led_2.clk clock
add_connection clk_0.clk nios_activity_led_3.clk clock
add_connection clk_0.clk nios_activity_led_4.clk clock
add_connection clk_0.clk onchip_memory2_0.clk1 clock
add_connection clk_0.clk onchip_memory2_1.clk1 clock
add_connection clk_0.clk onchip_memory2_2.clk1 clock
add_connection clk_0.clk onchip_memory2_3.clk1 clock
add_connection clk_0.clk onchip_memory2_4.clk1 clock
add_connection clk_0.clk sysid.clk clock
add_connection clk_0.clk timer_0.clk clock
add_connection clk_0.clk_reset address_span_extender_0.reset reset
add_connection clk_0.clk_reset fifoed_avalon_uart_0.reset reset
add_connection clk_0.clk_reset fifoed_avalon_uart_0_txenable.reset reset
add_connection clk_0.clk_reset fifoed_avalon_uart_1.reset reset
add_connection clk_0.clk_reset fifoed_avalon_uart_1_txenable.reset reset
add_connection clk_0.clk_reset fifoed_avalon_uart_2.reset reset
add_connection clk_0.clk_reset fifoed_avalon_uart_2_txenable.reset reset
add_connection clk_0.clk_reset fifoed_avalon_uart_3.reset reset
add_connection clk_0.clk_reset fifoed_avalon_uart_3_txenable.reset reset
add_connection clk_0.clk_reset fifoed_avalon_uart_4.reset reset
add_connection clk_0.clk_reset fifoed_avalon_uart_4_txenable.reset reset
add_connection clk_0.clk_reset fifoed_avalon_uart_5.reset reset
add_connection clk_0.clk_reset fifoed_avalon_uart_5_txenable.reset reset
add_connection clk_0.clk_reset hps_fpga_leds.reset reset
add_connection clk_0.clk_reset jtag_uart_0.reset reset
add_connection clk_0.clk_reset msgdma_0.reset_n reset
add_connection clk_0.clk_reset msgdma_1.reset_n reset
add_connection clk_0.clk_reset nios2_gen2_0.reset reset
add_connection clk_0.clk_reset nios2_gen2_1.reset reset
add_connection clk_0.clk_reset nios2_gen2_2.reset reset
add_connection clk_0.clk_reset nios2_gen2_3.reset reset
add_connection clk_0.clk_reset nios2_gen2_4.reset reset
add_connection clk_0.clk_reset nios_activity_led_0.reset reset
add_connection clk_0.clk_reset nios_activity_led_1.reset reset
add_connection clk_0.clk_reset nios_activity_led_2.reset reset
add_connection clk_0.clk_reset nios_activity_led_3.reset reset
add_connection clk_0.clk_reset nios_activity_led_4.reset reset
add_connection clk_0.clk_reset onchip_memory2_0.reset1 reset
add_connection clk_0.clk_reset onchip_memory2_1.reset1 reset
add_connection clk_0.clk_reset onchip_memory2_2.reset1 reset
add_connection clk_0.clk_reset onchip_memory2_3.reset1 reset
add_connection clk_0.clk_reset onchip_memory2_4.reset1 reset
add_connection clk_0.clk_reset sysid.reset reset
add_connection clk_0.clk_reset timer_0.reset reset
add_connection hps_0.h2f_reset hps_fpga_leds.reset reset
add_connection nios2_gen2_0.debug_reset_request jtag_uart_0.reset reset
add_connection nios2_gen2_0.debug_reset_request nios2_gen2_0.reset reset
add_connection nios2_gen2_0.debug_reset_request nios_activity_led_0.reset reset
add_connection nios2_gen2_0.debug_reset_request onchip_memory2_0.reset1 reset
add_connection nios2_gen2_0.debug_reset_request sysid.reset reset
add_connection nios2_gen2_1.debug_reset_request nios2_gen2_1.reset reset
add_connection nios2_gen2_1.debug_reset_request nios_activity_led_1.reset reset
add_connection nios2_gen2_1.debug_reset_request onchip_memory2_1.reset1 reset
add_connection nios2_gen2_2.debug_reset_request nios2_gen2_2.reset reset
add_connection nios2_gen2_2.debug_reset_request nios_activity_led_2.reset reset
add_connection nios2_gen2_2.debug_reset_request onchip_memory2_2.reset1 reset
add_connection nios2_gen2_3.debug_reset_request nios2_gen2_3.reset reset
add_connection nios2_gen2_3.debug_reset_request nios_activity_led_3.reset reset
add_connection nios2_gen2_3.debug_reset_request onchip_memory2_3.reset1 reset
add_connection nios2_gen2_4.debug_reset_request fifoed_avalon_uart_4.reset reset
add_connection nios2_gen2_4.debug_reset_request nios2_gen2_4.reset reset
add_connection nios2_gen2_4.debug_reset_request onchip_memory2_4.reset1 reset
add_connection address_span_extender_0.expanded_master hps_0.f2h_axi_slave avalon
set_connection_parameter_value address_span_extender_0.expanded_master/hps_0.f2h_axi_slave baseAddress 0x0000
add_connection hps_0.h2f_lw_axi_master hps_fpga_leds.s1 avalon
set_connection_parameter_value hps_0.h2f_lw_axi_master/hps_fpga_leds.s1 baseAddress 0x0000
add_connection msgdma_0.mm_read onchip_memory2_0.s1 avalon
set_connection_parameter_value msgdma_0.mm_read/onchip_memory2_0.s1 baseAddress 0x0000
add_connection msgdma_0.mm_write address_span_extender_0.windowed_slave avalon
set_connection_parameter_value msgdma_0.mm_write/address_span_extender_0.windowed_slave baseAddress 0x0000
add_connection msgdma_1.mm_read onchip_memory2_1.s1 avalon
set_connection_parameter_value msgdma_1.mm_read/onchip_memory2_1.s1 baseAddress 0x00040000
add_connection msgdma_1.mm_write address_span_extender_0.windowed_slave avalon
set_connection_parameter_value msgdma_1.mm_write/address_span_extender_0.windowed_slave baseAddress 0x0000
add_connection nios2_gen2_0.data_master fifoed_avalon_uart_0.s1 avalon
set_connection_parameter_value nios2_gen2_0.data_master/fifoed_avalon_uart_0.s1 baseAddress 0x00021040
add_connection nios2_gen2_0.data_master fifoed_avalon_uart_0_txenable.s1 avalon
set_connection_parameter_value nios2_gen2_0.data_master/fifoed_avalon_uart_0_txenable.s1 baseAddress 0x000210a0
add_connection nios2_gen2_0.data_master jtag_uart_0.avalon_jtag_slave avalon
set_connection_parameter_value nios2_gen2_0.data_master/jtag_uart_0.avalon_jtag_slave baseAddress 0x000210d0
add_connection nios2_gen2_0.data_master msgdma_0.csr avalon
set_connection_parameter_value nios2_gen2_0.data_master/msgdma_0.csr baseAddress 0x00021080
add_connection nios2_gen2_0.data_master msgdma_0.descriptor_slave avalon
set_connection_parameter_value nios2_gen2_0.data_master/msgdma_0.descriptor_slave baseAddress 0x000210c0
add_connection nios2_gen2_0.data_master nios2_gen2_0.debug_mem_slave avalon
set_connection_parameter_value nios2_gen2_0.data_master/nios2_gen2_0.debug_mem_slave baseAddress 0x00020800
add_connection nios2_gen2_0.data_master nios_activity_led_0.s1 avalon
set_connection_parameter_value nios2_gen2_0.data_master/nios_activity_led_0.s1 baseAddress 0x000210b0
add_connection nios2_gen2_0.data_master onchip_memory2_0.s1 avalon
set_connection_parameter_value nios2_gen2_0.data_master/onchip_memory2_0.s1 baseAddress 0x0000
add_connection nios2_gen2_0.data_master timer_0.s1 avalon
set_connection_parameter_value nios2_gen2_0.data_master/timer_0.s1 baseAddress 0x00021000
add_connection nios2_gen2_0.instruction_master nios2_gen2_0.debug_mem_slave avalon
set_connection_parameter_value nios2_gen2_0.instruction_master/nios2_gen2_0.debug_mem_slave baseAddress 0x00020800
add_connection nios2_gen2_0.instruction_master onchip_memory2_0.s1 avalon
set_connection_parameter_value nios2_gen2_0.instruction_master/onchip_memory2_0.s1 baseAddress 0x0000
add_connection nios2_gen2_1.data_master fifoed_avalon_uart_1.s1 avalon
set_connection_parameter_value nios2_gen2_1.data_master/fifoed_avalon_uart_1.s1 baseAddress 0x00021040
add_connection nios2_gen2_1.data_master fifoed_avalon_uart_1_txenable.s1 avalon
set_connection_parameter_value nios2_gen2_1.data_master/fifoed_avalon_uart_1_txenable.s1 baseAddress 0x000210c0
add_connection nios2_gen2_1.data_master msgdma_1.csr avalon
set_connection_parameter_value nios2_gen2_1.data_master/msgdma_1.csr baseAddress 0x00021080
add_connection nios2_gen2_1.data_master msgdma_1.descriptor_slave avalon
set_connection_parameter_value nios2_gen2_1.data_master/msgdma_1.descriptor_slave baseAddress 0x000210a0
add_connection nios2_gen2_1.data_master nios2_gen2_1.debug_mem_slave avalon
set_connection_parameter_value nios2_gen2_1.data_master/nios2_gen2_1.debug_mem_slave baseAddress 0x00020800
add_connection nios2_gen2_1.data_master nios_activity_led_1.s1 avalon
set_connection_parameter_value nios2_gen2_1.data_master/nios_activity_led_1.s1 baseAddress 0x000210b0
add_connection nios2_gen2_1.data_master onchip_memory2_1.s1 avalon
set_connection_parameter_value nios2_gen2_1.data_master/onchip_memory2_1.s1 baseAddress 0x00040000
add_connection nios2_gen2_1.data_master timer_0.s1 avalon
set_connection_parameter_value nios2_gen2_1.data_master/timer_0.s1 baseAddress 0x00021000
add_connection nios2_gen2_1.instruction_master nios2_gen2_1.debug_mem_slave avalon
set_connection_parameter_value nios2_gen2_1.instruction_master/nios2_gen2_1.debug_mem_slave baseAddress 0x00020800
add_connection nios2_gen2_1.instruction_master onchip_memory2_1.s1 avalon
set_connection_parameter_value nios2_gen2_1.instruction_master/onchip_memory2_1.s1 baseAddress 0x00040000
add_connection nios2_gen2_2.data_master fifoed_avalon_uart_2.s1 avalon
set_connection_parameter_value nios2_gen2_2.data_master/fifoed_avalon_uart_2.s1 baseAddress 0x00011040
add_connection nios2_gen2_2.data_master fifoed_avalon_uart_2_txenable.s1 avalon
set_connection_parameter_value nios2_gen2_2.data_master/fifoed_avalon_uart_2_txenable.s1 baseAddress 0x00011090
add_connection nios2_gen2_2.data_master nios2_gen2_2.debug_mem_slave avalon
set_connection_parameter_value nios2_gen2_2.data_master/nios2_gen2_2.debug_mem_slave baseAddress 0x00010800
add_connection nios2_gen2_2.data_master nios_activity_led_2.s1 avalon
set_connection_parameter_value nios2_gen2_2.data_master/nios_activity_led_2.s1 baseAddress 0x00011080
add_connection nios2_gen2_2.data_master onchip_memory2_2.s1 avalon
set_connection_parameter_value nios2_gen2_2.data_master/onchip_memory2_2.s1 baseAddress 0x00020000
add_connection nios2_gen2_2.data_master timer_0.s1 avalon
set_connection_parameter_value nios2_gen2_2.data_master/timer_0.s1 baseAddress 0x00011000
add_connection nios2_gen2_2.instruction_master nios2_gen2_2.debug_mem_slave avalon
set_connection_parameter_value nios2_gen2_2.instruction_master/nios2_gen2_2.debug_mem_slave baseAddress 0x00010800
add_connection nios2_gen2_2.instruction_master onchip_memory2_2.s1 avalon
set_connection_parameter_value nios2_gen2_2.instruction_master/onchip_memory2_2.s1 baseAddress 0x00020000
add_connection nios2_gen2_3.data_master fifoed_avalon_uart_3.s1 avalon
set_connection_parameter_value nios2_gen2_3.data_master/fifoed_avalon_uart_3.s1 baseAddress 0x00011040
add_connection nios2_gen2_3.data_master fifoed_avalon_uart_3_txenable.s1 avalon
set_connection_parameter_value nios2_gen2_3.data_master/fifoed_avalon_uart_3_txenable.s1 baseAddress 0x00011080
add_connection nios2_gen2_3.data_master nios2_gen2_3.debug_mem_slave avalon
set_connection_parameter_value nios2_gen2_3.data_master/nios2_gen2_3.debug_mem_slave baseAddress 0x00010800
add_connection nios2_gen2_3.data_master nios_activity_led_3.s1 avalon
set_connection_parameter_value nios2_gen2_3.data_master/nios_activity_led_3.s1 baseAddress 0x00011090
add_connection nios2_gen2_3.data_master onchip_memory2_3.s1 avalon
set_connection_parameter_value nios2_gen2_3.data_master/onchip_memory2_3.s1 baseAddress 0x00020000
add_connection nios2_gen2_3.data_master timer_0.s1 avalon
set_connection_parameter_value nios2_gen2_3.data_master/timer_0.s1 baseAddress 0x00011000
add_connection nios2_gen2_3.instruction_master nios2_gen2_3.debug_mem_slave avalon
set_connection_parameter_value nios2_gen2_3.instruction_master/nios2_gen2_3.debug_mem_slave baseAddress 0x00010800
add_connection nios2_gen2_3.instruction_master onchip_memory2_3.s1 avalon
set_connection_parameter_value nios2_gen2_3.instruction_master/onchip_memory2_3.s1 baseAddress 0x00020000
add_connection nios2_gen2_4.data_master fifoed_avalon_uart_4.s1 avalon
set_connection_parameter_value nios2_gen2_4.data_master/fifoed_avalon_uart_4.s1 baseAddress 0x00011040
add_connection nios2_gen2_4.data_master fifoed_avalon_uart_4_txenable.s1 avalon
set_connection_parameter_value nios2_gen2_4.data_master/fifoed_avalon_uart_4_txenable.s1 baseAddress 0x00011080
add_connection nios2_gen2_4.data_master nios2_gen2_4.debug_mem_slave avalon
set_connection_parameter_value nios2_gen2_4.data_master/nios2_gen2_4.debug_mem_slave baseAddress 0x00010800
add_connection nios2_gen2_4.data_master nios_activity_led_4.s1 avalon
set_connection_parameter_value nios2_gen2_4.data_master/nios_activity_led_4.s1 baseAddress 0x00011090
add_connection nios2_gen2_4.data_master onchip_memory2_4.s1 avalon
set_connection_parameter_value nios2_gen2_4.data_master/onchip_memory2_4.s1 baseAddress 0x00020000
add_connection nios2_gen2_4.data_master timer_0.s1 avalon
set_connection_parameter_value nios2_gen2_4.data_master/timer_0.s1 baseAddress 0x00011000
add_connection nios2_gen2_4.instruction_master nios2_gen2_4.debug_mem_slave avalon
set_connection_parameter_value nios2_gen2_4.instruction_master/nios2_gen2_4.debug_mem_slave baseAddress 0x00010800
add_connection nios2_gen2_4.instruction_master onchip_memory2_4.s1 avalon
set_connection_parameter_value nios2_gen2_4.instruction_master/onchip_memory2_4.s1 baseAddress 0x00020000
add_connection nios2_gen2_0.irq fifoed_avalon_uart_0.irq interrupt
set_connection_parameter_value nios2_gen2_0.irq/fifoed_avalon_uart_0.irq irqNumber 3
add_connection nios2_gen2_0.irq jtag_uart_0.irq interrupt
set_connection_parameter_value nios2_gen2_0.irq/jtag_uart_0.irq irqNumber 1
add_connection nios2_gen2_0.irq msgdma_0.csr_irq interrupt
set_connection_parameter_value nios2_gen2_0.irq/msgdma_0.csr_irq irqNumber 0
add_connection nios2_gen2_0.irq timer_0.irq interrupt
set_connection_parameter_value nios2_gen2_0.irq/timer_0.irq irqNumber 2
add_connection nios2_gen2_1.irq fifoed_avalon_uart_1.irq interrupt
set_connection_parameter_value nios2_gen2_1.irq/fifoed_avalon_uart_1.irq irqNumber 0
add_connection nios2_gen2_1.irq msgdma_1.csr_irq interrupt
set_connection_parameter_value nios2_gen2_1.irq/msgdma_1.csr_irq irqNumber 2
add_connection nios2_gen2_1.irq timer_0.irq interrupt
set_connection_parameter_value nios2_gen2_1.irq/timer_0.irq irqNumber 1
add_connection nios2_gen2_2.irq fifoed_avalon_uart_2.irq interrupt
set_connection_parameter_value nios2_gen2_2.irq/fifoed_avalon_uart_2.irq irqNumber 0
add_connection nios2_gen2_2.irq timer_0.irq interrupt
set_connection_parameter_value nios2_gen2_2.irq/timer_0.irq irqNumber 1
add_connection nios2_gen2_3.irq fifoed_avalon_uart_3.irq interrupt
set_connection_parameter_value nios2_gen2_3.irq/fifoed_avalon_uart_3.irq irqNumber 0
add_connection nios2_gen2_3.irq timer_0.irq interrupt
set_connection_parameter_value nios2_gen2_3.irq/timer_0.irq irqNumber 1
add_connection nios2_gen2_4.irq fifoed_avalon_uart_4.irq interrupt
set_connection_parameter_value nios2_gen2_4.irq/fifoed_avalon_uart_4.irq irqNumber 0
add_connection nios2_gen2_4.irq timer_0.irq interrupt
set_connection_parameter_value nios2_gen2_4.irq/timer_0.irq irqNumber 1

# exported interfaces
add_interface clk clock sink
set_interface_property clk EXPORT_OF clk_0.clk_in
add_interface fifoed_avalon_uart_0_external_connection conduit end
set_interface_property fifoed_avalon_uart_0_external_connection EXPORT_OF fifoed_avalon_uart_0.external_connection
add_interface fifoed_avalon_uart_0_txenable_external_connection conduit end
set_interface_property fifoed_avalon_uart_0_txenable_external_connection EXPORT_OF fifoed_avalon_uart_0_txenable.external_connection
add_interface fifoed_avalon_uart_1_external_connection conduit end
set_interface_property fifoed_avalon_uart_1_external_connection EXPORT_OF fifoed_avalon_uart_1.external_connection
add_interface fifoed_avalon_uart_1_txenable_external_connection conduit end
set_interface_property fifoed_avalon_uart_1_txenable_external_connection EXPORT_OF fifoed_avalon_uart_1_txenable.external_connection
add_interface hps_0_ddr conduit end
set_interface_property hps_0_ddr EXPORT_OF hps_0.memory
add_interface hps_0_io conduit end
set_interface_property hps_0_io EXPORT_OF hps_0.hps_io
add_interface hps_fpga_leds_external_connection conduit end
set_interface_property hps_fpga_leds_external_connection EXPORT_OF hps_fpga_leds.external_connection
add_interface nios_activity_led_external_connection_0 conduit end
set_interface_property nios_activity_led_external_connection_0 EXPORT_OF nios_activity_led_0.external_connection
add_interface nios_activity_led_external_connection_1 conduit end
set_interface_property nios_activity_led_external_connection_1 EXPORT_OF nios_activity_led_1.external_connection
add_interface reset reset sink
set_interface_property reset EXPORT_OF clk_0.clk_in_reset

set_interconnect_requirement {$system} qsys_mm.clockCrossingAdapter HANDSHAKE
set_interconnect_requirement {$system} qsys_mm.enableEccProtection FALSE
set_interconnect_requirement {$system} qsys_mm.insertDefaultSlave FALSE
set_interconnect_requirement {$system} qsys_mm.maxAdditionalLatency 1

save_system soc_system.qsys
